# EAGLE schematic gobabygo_motor_controller (EAGLE 9.0.1)
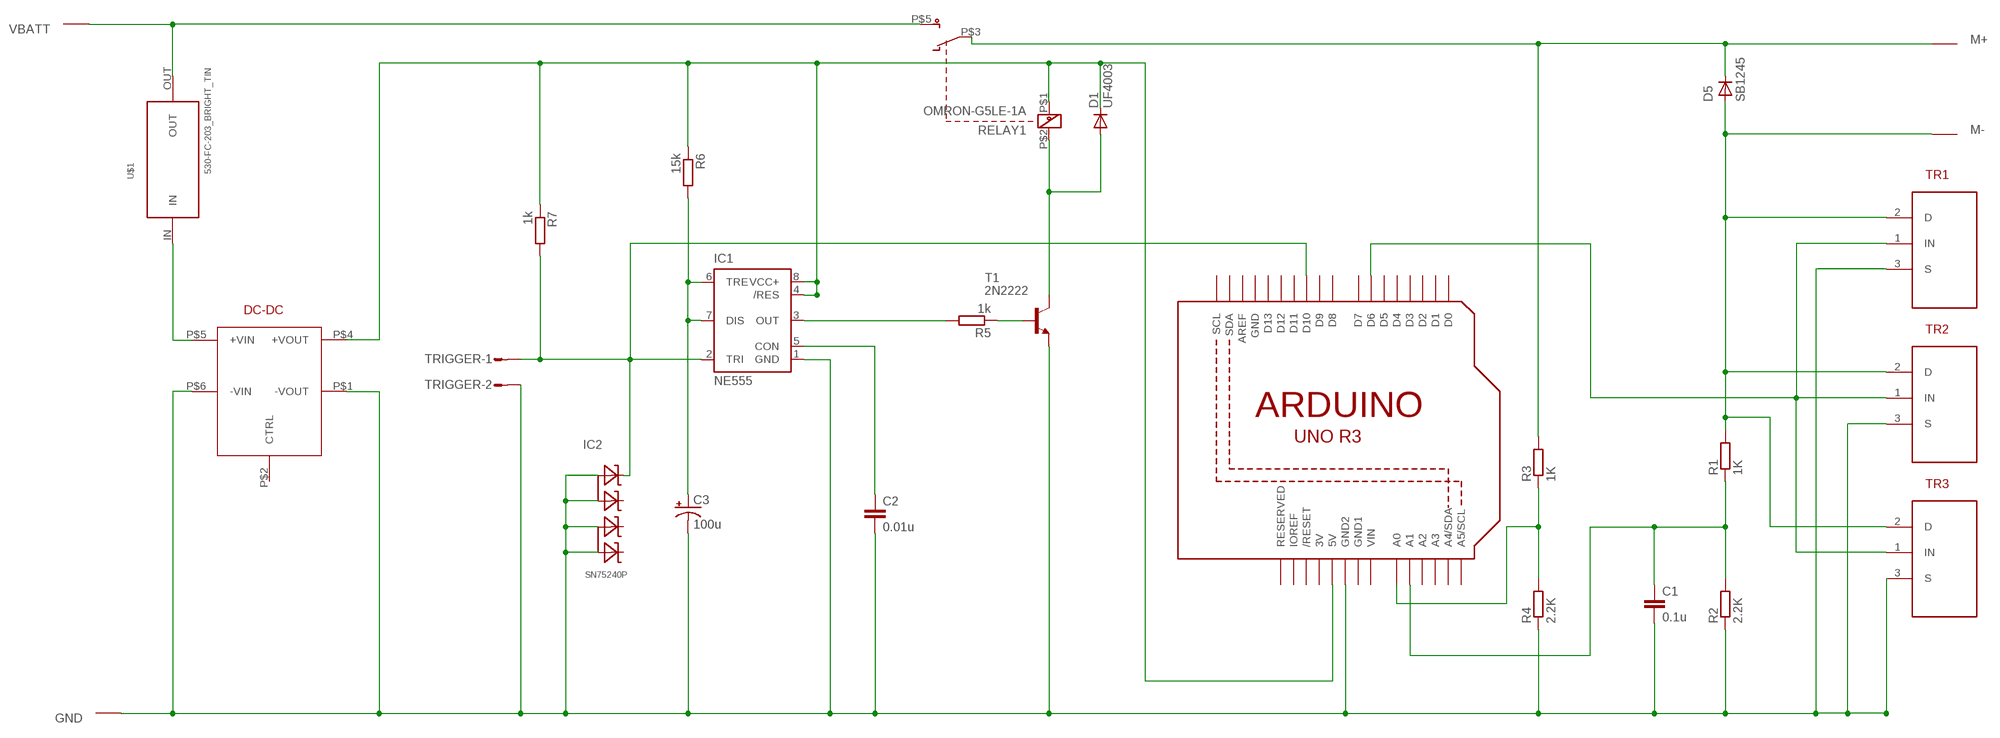
[diagram p0: schematic, sheet 1]

## Parts
ARDUINO-UNO  ARDUINOR3-DIMENSION  [ARDUINOR3]
C1  0.1u  C2,5-3  [C2.5-3]
C2  0.01u  C2,5-3  [C2.5-3]
C3  100u  CPOL-USE3.5-8  [E3,5-8]
D1  UF4003  [DO41-10]
D5  SB1245  [DO-201]
DC-DC  NCS1S1205SC  [NCS1S1205SC]
GND  1287-ST-CONNECTOR  [F-TERMINAL]
IC1  NE555  [DIL-08]
IC2  SN75240P  [DIL08]
M+  1287-ST-CONNECTOR  [F-TERMINAL]
M-  1287-ST-CONNECTOR  [F-TERMINAL]
R1  1K  R-EU_0204/7  [0204/7]
R2  2.2K  R-EU_0204/7  [0204/7]
R3  1K  R-EU_0204/7  [0204/7]
R4  2.2K  R-EU_0204/7  [0204/7]
R5  1k  R-EU_0204/7  [0204/7]
R6  15k  R-EU_0204/7  [0204/7]
R7  1k  R-EU_0204/7  [0204/7]
RELAY1  OMRON-G5LE-1A  [OMRON-G5LE-1A]
T1  2N2222  [TO92-EBC-OVAL]
TR1  BTS117BKSA1  [BTS117-THRU-HOLE]
TR2  BTS117BKSA1  [BTS117-THRU-HOLE]
TR3  BTS117BKSA1  [BTS117-THRU-HOLE]
TRIGGER  S02P  [S02P]
U$1  530-FC-203_BRIGHT_TIN  [530-FC-203-PAIR]
VBATT  1287-ST-CONNECTOR  [F-TERMINAL]

## Nets
GND: ARDUINO-UNO.GND2 C1.2 C2.2 C3.- DC-DC.P$1(-VOUT) DC-DC.P$6(-VIN) GND.P$1 IC1.1(GND) IC2.1(A4) IC2.3(A3) IC2.5(A2) IC2.7(A1) R2.1 R4.1 T1.E TR1.3(S) TR2.3(S) TR3.3(S) TRIGGER.2
MOTOR+: D5.C M+.P$1 R3.2 RELAY1.P$3
N$1: DC-DC.P$5(+VIN) U$1.IN
N$2: D5.A M-.P$1 R1.2 TR1.2(D) TR2.2(D) TR3.2(D)
N$3: ARDUINO-UNO.D6 TR1.1(IN) TR2.1(IN) TR3.1(IN)
N$5: ARDUINO-UNO.A0 R3.1 R4.2
N$6: ARDUINO-UNO.A1 C1.1 R1.1 R2.2
N$7: ARDUINO-UNO.D10 IC1.2(TRI) IC2.8(C1) R7.2 TRIGGER.1
N$8: D1.A RELAY1.P$2 T1.C
N$9: R5.1 T1.B
N$10: IC1.3(OUT) R5.2
N$11: RELAY1.P$5 U$1.OUT VBATT.P$1
N$12: C2.1 IC1.5(CON)
N$13: C3.+ IC1.6(TRE) IC1.7(DIS) R6.2
N$14: ARDUINO-UNO.5V D1.C DC-DC.P$4(+VOUT) IC1.4(/RES) IC1.8(VCC+) R6.1 R7.1 RELAY1.P$1
Unconnected: ARDUINO-UNO.A2 ARDUINO-UNO.A3 ARDUINO-UNO.A4(A4/SDA) ARDUINO-UNO.A5(A5/SCL) ARDUINO-UNO.AREF ARDUINO-UNO.D0 ARDUINO-UNO.D1 ARDUINO-UNO.D2 ARDUINO-UNO.D3 ARDUINO-UNO.D4 ARDUINO-UNO.D5 ARDUINO-UNO.D7 ARDUINO-UNO.D8 ARDUINO-UNO.D9 ARDUINO-UNO.D11 ARDUINO-UNO.D12 ARDUINO-UNO.D13 ARDUINO-UNO.IOREF ARDUINO-UNO.RESERVED ARDUINO-UNO.RESET(/RESET) ARDUINO-UNO.SCL ARDUINO-UNO.SDA DC-DC.P$2(CTRL) IC2.2(C4) IC2.4(C3) IC2.6(C2)

## Power pins joined to a net without a drawn wire
3V: ARDUINO-UNO.3V
GND: ARDUINO-UNO.GND
GND1: ARDUINO-UNO.GND1
VIN: ARDUINO-UNO.VIN

## Library data of the parts
ARDUINO-UNO = adafruit:ARDUINOR3: This is a new object for the new Arduino R3 - with extra pins that you may want to use (such as IOref, and duplicated A4/A5
C1 C2 = capacitor-wima:C: CAPACITOR naming: grid - package width
C3 = adafruit:CPOL-US: POLARIZED CAPACITOR, American symbol
D1 = diode:UF4003: DIODE ultrafast recovery diode, 200 V rectifier
D5 = gobabygo_motorcontroller:SB1245
DC-DC = gobabygo_motorcontroller:NCS1S1205SC
GND M+ M- VBATT = gobabygo_motorcontroller:1287-ST-CONNECTOR
IC1 = st-microelectronics:NE555: General purpose bipolar Timer; MF: Arrow Electronics; MPN: NE555N; OC_FARNELL: 1467742; OC_NEWARK: 89K1486
IC2 = gobabygo_motorcontroller:SN75240P
R1-R7 = resistor:R-EU_: RESISTOR, European symbol
RELAY1 = gobabygo_motorcontroller:OMRON-G5LE-1A
T1 = adafruit:2N2222: NPN TRANSISTOR Big oval pads
TR1-TR3 = gobabygo_motorcontroller:BTS117BKSA1: Power Switch ICs - Power Distribution HITFET
TRIGGER = con-amp-mt:S02P: AMP MT CONNECTOR; OC_FARNELL: unknown; OC_NEWARK: unknown
U$1 = gobabygo_motorcontroller:530-FC-203_BRIGHT_TIN: Fuse clips